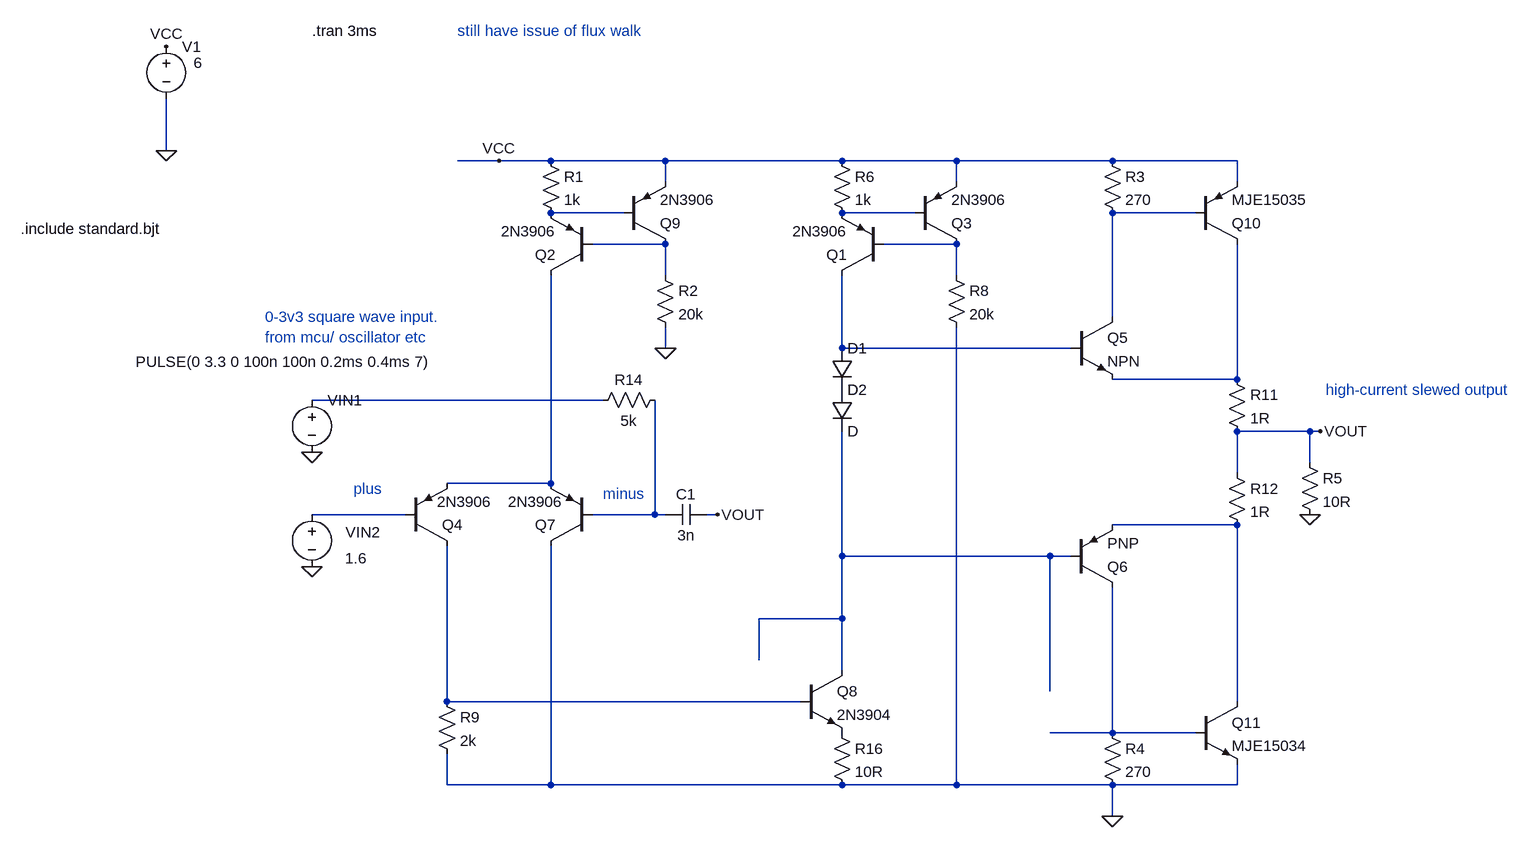
[diagram p0: schematic Draft46.asc]
Draft46.asc, the LTspice schematic file:
Version 4
SHEET 1 1768 952
WIRE -336 -208 -336 -288
WIRE 176 -192 112 -192
WIRE 256 -192 176 -192
WIRE 432 -192 256 -192
WIRE 704 -192 432 -192
WIRE 880 -192 704 -192
WIRE 1120 -192 880 -192
WIRE 1312 -192 1120 -192
WIRE 432 -160 432 -192
WIRE 880 -160 880 -192
WIRE 1312 -160 1312 -192
WIRE 368 -112 256 -112
WIRE 816 -112 704 -112
WIRE 1248 -112 1120 -112
WIRE 432 -64 320 -64
WIRE 880 -64 768 -64
WIRE 432 -16 432 -64
WIRE 880 -16 880 -64
WIRE 1120 48 1120 -112
WIRE 432 96 432 64
WIRE 704 96 704 -16
WIRE 1056 96 704 96
WIRE 1312 144 1312 -64
WIRE 1312 144 1120 144
WIRE 336 176 -112 176
WIRE 1424 224 1312 224
WIRE 1440 224 1424 224
WIRE 1424 272 1424 224
WIRE 1312 288 1312 224
WIRE 256 304 256 -16
WIRE 256 304 96 304
WIRE 32 352 -112 352
WIRE 416 352 416 176
WIRE 416 352 320 352
WIRE 432 352 416 352
WIRE 512 352 496 352
WIRE 1312 368 1120 368
WIRE 704 416 704 224
WIRE 1024 416 704 416
WIRE 1056 416 1024 416
WIRE 704 512 704 416
WIRE 704 512 576 512
WIRE 576 576 576 512
WIRE 704 592 704 512
WIRE 1024 624 1024 416
WIRE 96 640 96 400
WIRE 640 640 96 640
WIRE 1312 640 1312 368
WIRE 1120 688 1120 464
WIRE 1120 688 1024 688
WIRE 1248 688 1120 688
WIRE 96 768 96 720
WIRE 256 768 256 400
WIRE 256 768 96 768
WIRE 704 768 256 768
WIRE 880 768 880 64
WIRE 880 768 704 768
WIRE 1120 768 880 768
WIRE 1312 768 1312 736
WIRE 1312 768 1120 768
WIRE 1120 816 1120 768
FLAG -336 -368 VCC
FLAG 1440 224 VOUT
FLAG -112 256 0
FLAG 176 -192 VCC
FLAG 512 352 VOUT
FLAG 432 96 0
FLAG 1120 816 0
FLAG -336 -208 0
FLAG -112 432 0
FLAG 1424 352 0
SYMBOL pnp 768 -16 R180
SYMATTR InstName Q1
SYMATTR Value 2N3906
SYMBOL pnp 816 -64 M180
SYMATTR InstName Q3
SYMATTR Value 2N3906
SYMBOL res 688 -208 R0
SYMATTR InstName R6
SYMATTR Value 1k
SYMBOL voltage -336 -384 R0
WINDOW 123 0 0 Left 0
WINDOW 39 0 0 Left 0
WINDOW 3 42 41 Left 2
SYMATTR Value 6
SYMATTR InstName V1
SYMBOL res 864 -32 R0
SYMATTR InstName R8
SYMATTR Value 20k
SYMBOL npn 1056 48 R0
SYMATTR InstName Q5
SYMBOL res 1296 128 R0
SYMATTR InstName R11
SYMATTR Value 1R
SYMBOL res 1296 272 R0
SYMATTR InstName R12
SYMATTR Value 1R
SYMBOL pnp 1056 464 M180
SYMATTR InstName Q6
SYMBOL voltage -112 160 R0
WINDOW 123 0 0 Left 0
WINDOW 39 0 0 Left 0
WINDOW 3 -271 -43 Left 2
SYMATTR Value PULSE(0 3.3 0 100n 100n 0.2ms 0.4ms 7)
SYMATTR InstName VIN1
SYMBOL res 80 624 R0
SYMATTR InstName R9
SYMATTR Value 2k
SYMBOL res 320 192 R270
WINDOW 0 32 56 VTop 2
WINDOW 3 0 56 VBottom 2
SYMATTR InstName R14
SYMATTR Value 5k
SYMBOL res 688 672 R0
SYMATTR InstName R16
SYMATTR Value 10R
SYMBOL pnp 32 400 M180
WINDOW 3 49 68 Left 2
SYMATTR Value 2N3906
SYMATTR InstName Q4
SYMBOL pnp 320 400 R180
WINDOW 3 45 68 Left 2
SYMATTR Value 2N3906
SYMATTR InstName Q7
SYMBOL npn 640 592 R0
SYMATTR InstName Q8
SYMATTR Value 2N3904
SYMBOL pnp 320 -16 R180
SYMATTR InstName Q2
SYMATTR Value 2N3906
SYMBOL pnp 368 -64 M180
SYMATTR InstName Q9
SYMATTR Value 2N3906
SYMBOL res 240 -208 R0
SYMATTR InstName R1
SYMATTR Value 1k
SYMBOL res 416 -32 R0
SYMATTR InstName R2
SYMATTR Value 20k
SYMBOL diode 688 96 R0
SYMATTR InstName D1
SYMBOL diode 688 160 R0
SYMATTR InstName D2
SYMBOL cap 496 336 R90
WINDOW 0 0 32 VBottom 2
WINDOW 3 32 32 VTop 2
SYMATTR InstName C1
SYMATTR Value 3n
SYMBOL voltage -112 336 R0
WINDOW 123 0 0 Left 0
WINDOW 39 0 0 Left 0
WINDOW 3 51 83 Left 2
WINDOW 0 52 43 Left 2
SYMATTR Value 1.6
SYMATTR InstName VIN2
SYMBOL res 1104 -208 R0
SYMATTR InstName R3
SYMATTR Value 270
SYMBOL res 1104 672 R0
SYMATTR InstName R4
SYMATTR Value 270
SYMBOL pnp 1248 -64 M180
SYMATTR InstName Q10
SYMATTR Value MJE15035
SYMBOL npn 1248 640 R0
SYMATTR InstName Q11
SYMATTR Value MJE15034
SYMBOL res 1408 256 R0
SYMATTR InstName R5
SYMATTR Value 10R
TEXT -112 -392 Left 2 !.tran 3ms
TEXT 336 320 Left 2 ;minus
TEXT -48 312 Left 2 ;plus
TEXT -184 48 Left 2 ;0-3v3 square wave input.\nfrom mcu/ oscillator etc
TEXT 1448 160 Left 2 ;high-current slewed output
TEXT -560 -88 Left 2 !.include standard.bjt
TEXT 112 -392 Left 2 ;still have issue of flux walk

The netlist it stands for:
* Draft46.asc
Q1 N006 N005 N002 0 2N3906
Q3 N005 N002 VCC 0 2N3906
R6 VCC N002 1k
V1 VCC 0 6
R8 N005 0 20k
Q5 N003 N006 N007 0 NPN
R11 N007 VOUT 1R
R12 VOUT N012 1R
Q6 N015 N013 N012 0 PNP
VIN1 N008 0 PULSE(0 3.3 0 100n 100n 0.2ms 0.4ms 7)
R9 N014 0 2k
R14 N008 N011 5k
R16 P001 0 10R
Q4 N014 N010 N009 0 2N3906
Q7 0 N011 N009 0 2N3906
Q8 N013 N014 P001 0 2N3904
Q2 N009 N004 N001 0 2N3906
Q9 N004 N001 VCC 0 2N3906
R1 VCC N001 1k
R2 N004 0 20k
D1 N006 P002 D
D2 P002 N013 D
C1 VOUT N011 3n
VIN2 N010 0 1.6
R3 VCC N003 270
R4 N015 0 270
Q10 N007 N003 VCC 0 MJE15035
Q11 N012 N015 0 0 MJE15034
R5 VOUT 0 10R
.model D D
.lib standard.dio
.model NPN NPN
.model PNP PNP
.lib standard.bjt
.tran 3ms
* minus
* plus
* 0-3v3 square wave input.
* from mcu/ oscillator etc
* high-current slewed output
.include standard.bjt
* still have issue of flux walk
.backanno
.end